# Altium schematic sheet ROL2-B1-P02.SchDoc
size A3
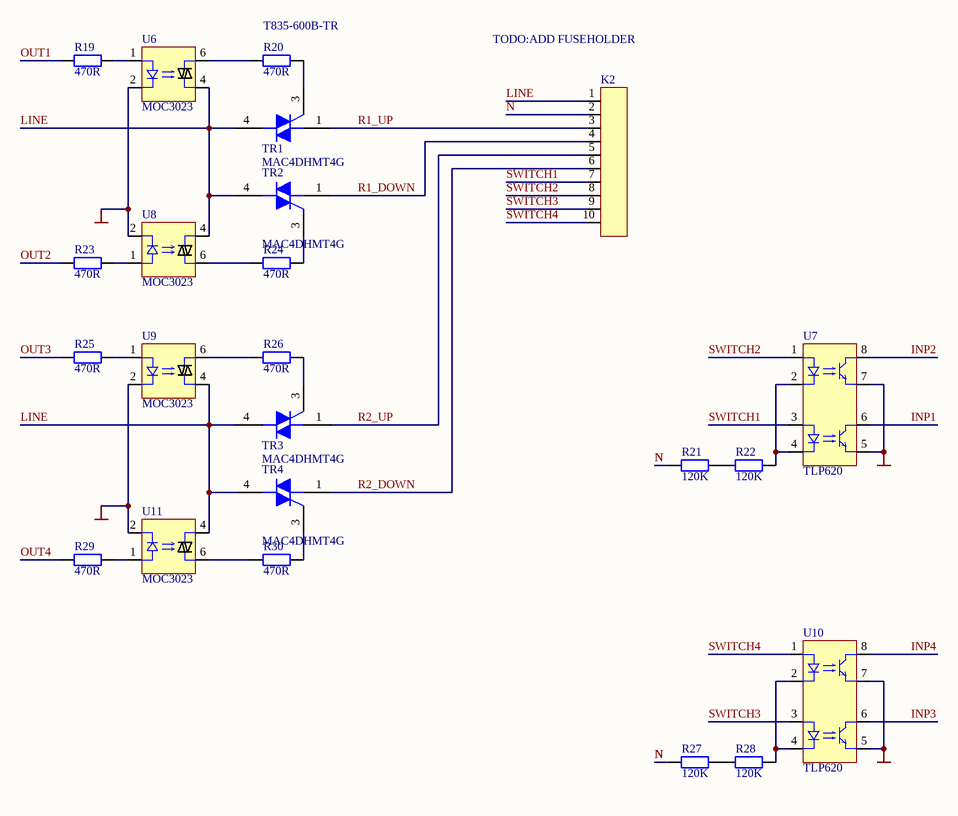
[diagram p0: ROL2-B1-P02.SchDoc]

## Parts
K2  Terminal Block Connector, 3.81mm, Right Angle  [CONN_3.81_10]  (value not drawn)
R19  470R  [RC0805-1]
R20  470R  [RC0805-1]
R21  120K  [RC1206-1]
R22  120K  [RC1206-1]
R23  470R  [RC0805-1]
R24  470R  [RC0805-1]
R25  470R  [RC0805-1]
R26  470R  [RC0805-1]
R27  120K  [RC1206-1]
R28  120K  [RC1206-1]
R29  470R  [RC0805-1]
R30  470R  [RC0805-1]
TR1  MAC4DHMT4G  [ONSC-DPAK-3-369C-01_V]
TR2  MAC4DHMT4G  [ONSC-DPAK-3-369C-01_V]
TR3  MAC4DHMT4G  [ONSC-DPAK-3-369C-01_V]
TR4  MAC4DHMT4G  [ONSC-DPAK-3-369C-01_V]
U6  MOC3023  [DIP6]
U7  TLP620  [DIP8]
U8  MOC3023  [DIP6]
U9  MOC3023  [DIP6]
U10  TLP620  [DIP8]
U11  MOC3023  [DIP6]

## Nets
GND: U6.2(K) U7.5(E) U7.7(E) U8.2(K) U9.2(K) U10.5(E) U10.7(E) U11.2(K)
INP1: U7.6(C)
INP2: U7.8(C)
INP3: U10.6(C)
INP4: U10.8(C)
LINE: K2.1(A) TR1.4(MT2) TR2.4(MT2) TR3.4(MT2) TR4.4(MT2) U6.4(E) U8.4(E) U9.4(E) U11.4(E)
N: K2.2(K) R21.1 R27.1
OUT1: R19.2
OUT2: R23.2
OUT3: R25.2
OUT4: R29.2
R1_DOWN: K2.4(K) TR2.1(MT1)
R1_UP: K2.3(A) TR1.1(MT1)
R2_DOWN: K2.6(C) TR4.1(MT1)
R2_UP: K2.5(E) TR3.1(MT1)
SWITCH1: K2.7(E) U7.3(A)
SWITCH2: K2.8(C) U7.1(A)
SWITCH3: K2.9(C) U10.3(A)
SWITCH4: K2.10(C) U10.1(A)
NetR19_1: R19.1 U6.1(A)
NetR20_1: R20.1 TR1.3(G)
NetR20_2: R20.2 U6.6(C)
NetR21_2: R21.2 R22.1
NetR22_2: R22.2 U7.2(K) U7.4(K)
NetR23_1: R23.1 U8.1(A)
NetR24_1: R24.1 TR2.3(G)
NetR24_2: R24.2 U8.6(C)
NetR25_1: R25.1 U9.1(A)
NetR26_1: R26.1 TR3.3(G)
NetR26_2: R26.2 U9.6(C)
NetR27_2: R27.2 R28.1
NetR28_2: R28.2 U10.2(K) U10.4(K)
NetR29_1: R29.1 U11.1(A)
NetR30_1: R30.1 TR4.3(G)
NetR30_2: R30.2 U11.6(C)

## Notes on the sheet
- (near R20) T835-600B-TR
- TODO:ADD FUSEHOLDER
- Title
- Size:
- Date:
- A3
- Number:
- Time:
- Revision:
- Sheet
- of
- File:

## Library data of the parts
K2 = CONN_TB_3.81_10PIN: Terminal Block Connector, 3.81mm, 8pin
R19 R20 R23-R26 R29 R30 = RES0805: Chip Resistor 0805; Comment2: 0.125W 1% 200ppm; Sort: 110; Tech: SMDR; Package: Res Chip 0805; Price: 0.002
R21 R22 R27 R28 = RES1206: Chip Resistor 1206; Comment2: 0.25W 1% 200ppm; Sort: 110; Tech: SMDR; Package: Res Chip 1206; Price: 0.002
TR1-TR4 = MAC4DHMT4G: Sensitive Gate Triacs, 3-Pin DPAK, Pb-Free, Tape and Reel; Manufacturer: On Semiconductor; IT(RMS) Max (A): 4; ITSM Max (A): 40; DatasheetVersion: Rev. 6; PackageVersion: Rev. E, 02/2014; PackageReference: DPAK-3-369C-01; PackageDescription: 3-Pin Flange Mount, Body 6.54 x 6.095 mm, Pitch 2.29 mm; Supplier 1: Digi-Key; Supplier Part Number 1: MAC4DHMT4GOSTR-ND; Supplier 2: Digi-Key; Supplier Part Number 2: MAC4DHMT4GOSCT-ND; Supplier 3: Digi-Key; Supplier Part Number 3: MAC4DHMT4GOSDKR-ND; Supplier 4: Farnell; Supplier Part Number 4: 1258364; Supplier 5: Newark; Supplier Part Number 5: 41K9936; Supplier 6: Mouser; Supplier Part Number 6: 863-MAC4DHMT4G; Packing: Tape and Reel; RoHS: Pb-Free; Mounting Technology: Surface Mount; PartNumber: MAC4DHMT4G; ComponentLink1Description: Manufacturer URL; ComponentLink1URL: http://www.onsemi.com/; ComponentLink2Description: Datasheet; ComponentLink2URL: http://www.onsemi.com/pub_link/Collateral/MAC4DHM-D.PDF; ComponentLink3Description: Package Specification; ComponentLink3URL: http://www.onsemi.cn/pub_link/Collateral/369C.PDF
U6 U8 U9 U11 = MOC3023: digital temperature sensor
U7 U10 = TLP620: digital temperature sensor